# Altium schematic sheet PX4FLOW2.0_Power_X0.SchDoc
size A3; DrawnBy: Philip Rowse
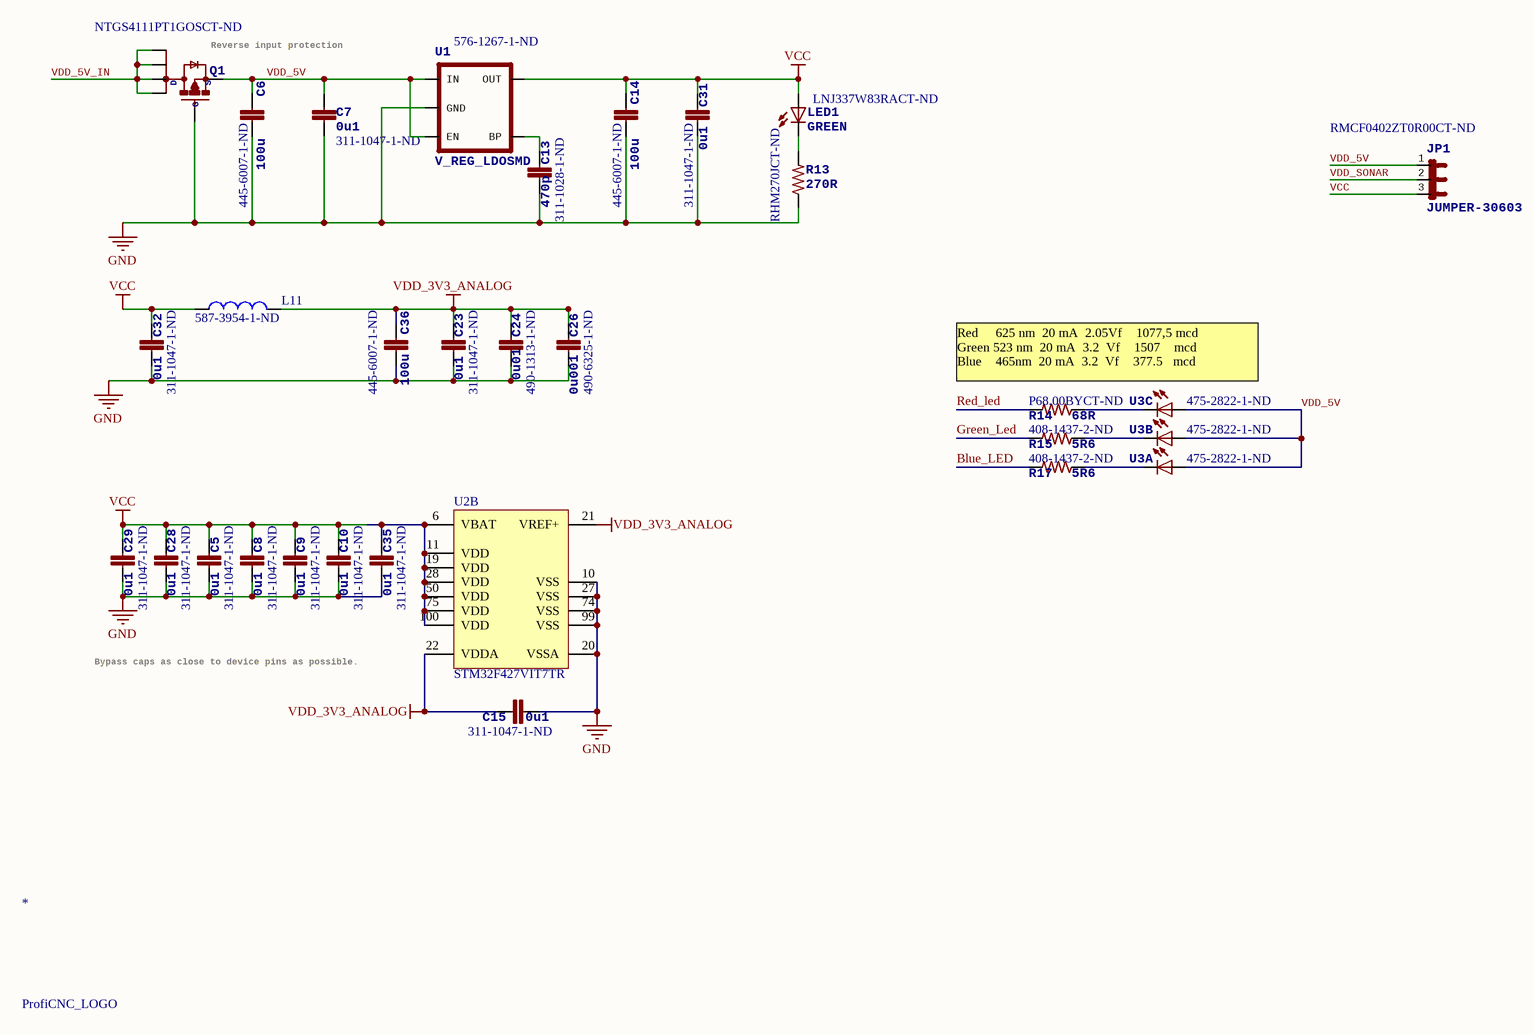
[diagram p0: PX4FLOW2.0_Power_X0.SchDoc]

## Parts
*  ProfiCNC_LOGO  [ProfiCNC_medium]  (no BOM)
C5  0u1  Supplier Part Number 1: 311-1047-1-ND  [0402-CAP]
C6  100u  Supplier Part Number 1: 445-6007-1-ND  [1206-CAP]
C7  0u1  Supplier Part Number 1: 311-1047-1-ND  [0402-CAP]
C8  0u1  Supplier Part Number 1: 311-1047-1-ND  [0402-CAP]
C9  0u1  Supplier Part Number 1: 311-1047-1-ND  [0402-CAP]
C10  0u1  Supplier Part Number 1: 311-1047-1-ND  [0402-CAP]
C13  470p  Supplier Part Number 1: 311-1028-1-ND  [0402-CAP]
C14  100u  Supplier Part Number 1: 445-6007-1-ND  [1206-CAP]
C15  0u1  Supplier Part Number 1: 311-1047-1-ND  [0402-CAP]
C23  0u1  Supplier Part Number 1: 311-1047-1-ND  [0402-CAP]
C24  0u01  Supplier Part Number 1: 490-1313-1-ND  [0402-CAP]
C26  0u001  Supplier Part Number 1: 490-6325-1-ND  [0402-CAP]
C28  0u1  Supplier Part Number 1: 311-1047-1-ND  [0402-CAP]
C29  0u1  Supplier Part Number 1: 311-1047-1-ND  [0402-CAP]
C31  0u1  Supplier Part Number 1: 311-1047-1-ND  [0402-CAP]
C32  0u1  Supplier Part Number 1: 311-1047-1-ND  [0402-CAP]
C35  0u1  Supplier Part Number 1: 311-1047-1-ND  [0402-CAP]
C36  100u  Supplier Part Number 1: 445-6007-1-ND  [1206-CAP]
JP1  JUMPER-30603  Supplier Part Number 1: RMCF0402ZT0R00CT-ND  [SJ_3_0603_PASTE1&2]
L11  Supplier Part Number 1: 587-3954-1-ND  [L0402]  (hidden comment: Inductor)
LED1  GREEN  Supplier Part Number 1: LNJ337W83RACT-ND  [LED-0603]
Q1  Supplier Part Number 1: NTGS4111PT1GOSCT-ND  [TSOP-6]  (hidden comment: NTGS4111P)
R13  270R  Supplier Part Number 1: RHM270JCT-ND  [R0402]
R14  68R  Supplier Part Number 1: P68.00BYCT-ND  [0603-RES]
R15  5R6  Supplier Part Number 1: 408-1437-2-ND  [0603-RES]
R17  5R6  Supplier Part Number 1: 408-1437-2-ND  [0603-RES]
U1  V_REG_LDOSMD  Supplier Part Number 1: 576-1267-1-ND  [SOT23-5]
U2  STM32F427VIT7TR  [STM-LQFP100_N]  (part B of 2)
U3  Supplier Part Number 1: 475-2822-1-ND  [6-PLCC]  (hidden comment: LRTB GFTG-T7AW-1+V7A7-29+R5T9-49-L)  (parts A,B,C of 3)

## Nets
GND: C5.2 C6.P$2 C7.1 C8.2 C9.2 C10.2 C13.2 C14.P$2 C15.2 C23.2 C24.2 C26.2 C28.2 C29.2 C31.2 C32.2 C35.2 C36.P$2 Q1.3(G) R13.1 U1.2(GND) U2.10(VSS) U2.20(VSSA) U2.27(VSS) U2.74(VSS) U2.99(VSS)
VCC: C5.1 C8.1 C9.1 C10.1 C14.P$1 C28.1 C29.1 C31.1 C32.1 C35.1 JP1.3 L11.1 LED1.A U1.5(OUT) U2.6(VBAT) U2.11(VDD) U2.19(VDD) U2.28(VDD) U2.50(VDD) U2.75(VDD) U2.100(VDD)
VDD_3V3_ANALOG: C15.1 C23.1 C24.1 C26.1 C36.P$1 L11.2 U2.21(VREF+) U2.22(VDDA)
Blue_LED: R17.2
Green_Led: R15.2
Red_led: R14.2
VDD_5V: C6.P$1 C7.2 JP1.1 Q1.4(S) U1.1(IN) U1.3(EN) U3.A1(A) U3.A2(A) U3.A3(A)
VDD_5V_IN: Q1.1(D) Q1.2(D1) Q1.5(D2) Q1.6(D3)
VDD_SONAR: JP1.2
NetC13_1: C13.1 U1.4(BP)
NetLED1_C: LED1.C R13.2
NetR14_1: R14.1 U3.C3(C)
NetR15_1: R15.1 U3.C2(C)
NetR17_1: R17.1 U3.C1(C)

## Notes on the sheet
- (near Q1) Reverse input protection
- Red     625 nm  20 mA  2.05Vf    1077,5 mcd
  Green 523 nm  20 mA  3.2  Vf    1507    mcd
  Blue    465nm  20 mA  3.2  Vf    377.5   mcd
- Bypass caps as close to device pins as possible.
- http://www.oshwa.org/
- http://creativecommons.org/licenses/by-sa/3.0/
- Title:
- Date:
- Time:
- Sheet:
- Approved:
- of:
- Drawn By:
- Checked By:
- ProfiCNC

## Library data of the parts
C5 C7-C10 C15 C23 C24 C26 C28 C29 C31 C32 = CAP0402-CAP: CapacitorStandard 0603 ceramic capacitor, and 0.1" leaded capacitor.; PARTNO: CC0402ZRY5V7BB104; Supplier 1: Digi-Key
C6 C14 C36 = CAP1206: CAP CER 100UF 10V 20% X5R 1206; PARTNO: C3216X5R1A107M160AC; 3DR_PARTNO: ECM0716; Supplier 1: Digi-Key; Value: 100U
C13 = CAP0402-CAP: CapacitorStandard 0603 ceramic capacitor, and 0.1" leaded capacitor.; PARTNO: CC0402KRX7R9BB471; Supplier 1: Digi-Key
C35 = CAP0402-CAP: 0402; PARTNO: CC0402ZRY5V7BB104; Supplier 1: Digi-Key
JP1 = JUMPER-30603: PARTNO: RMCF0402ZT0R00; Supplier 1: Digi-Key
L11 = Inductor: FERRITE BEAD 120 OHM 0402; Supplier 1: Digi-Key
LED1 = LED0603: Green LED; PARTNO: LNJ337W83RA; Supplier 1: Digi-Key
R13 = RESISTOR0402-RES: ResistorBasic schematic elements and footprints for 0603, 1206, and PTH 1/10th watt (small) resistors.; PARTNO: MCR01MZPJ271; Supplier 1: Digi-Key
R14 = RESISTOR0402-RES: RES SMD 68 OHM 1% 1/4W 0603; PARTNO: ERJ-PA3F68R0V; Supplier 1: Digi-Key
R15 R17 = RESISTOR0402-RES: RES SMD 5.6 OHM 1% 1/5W 0603; PARTNO: RL0816S-5R6-F; Supplier 1: Digi-Key
U1 = V_REG_LDOSMD: Voltage Regulator LDOStandard 150mA LDO voltage regulator in SOT-23 layout. Micrel part MIC5205. BP (by-pass) pin is used to lower output noise with 470pF cap.; PARTNO: MIC5207-3.3YM5; Supplier 1: Digi-Key
U2 = STM32F427VIT7TR: ARM Cortex-M4 32-bit MCU+FPU, 210 DMIPS, 2048 kB Flash, 256 kB Internal RAM, 82 I/Os, 100-pin LQFP, -40 to 105 degC, Tape and Reel; Manufacturer: STMicroelectronics; D/A Converter: 2x12-bit; FLASH Size (Prog) (kB): 2048; I/Os (High Current): 82; Internal RAM Size (kB): 256; Operating Frequency(F) (Processor speed) (MHz): 168; Supply Voltage(Vcc) max (V): 3.6; Supply Voltage(Vcc) min (V): 1.8; DatasheetVersion: Rev. 1; PackageVersion: Rev. 1, 06/2013; PackageReference: LQFP100; PackageDescription: 100-Pin Low Profile Quad Flat Package, 14 x 14 mm Body, 0.5 mm Pitch; Supplier 1: Newark; Supplier Part Number 1: 19X6230; Supplier 2: Mouser; Supplier Part Number 2: 511-STM32F427VIT7TR; Core: ARM Cortex-M4; Packing: Tape and Reel; Mounting Technology: Surface Mount; PartNumber: STM32F427VIT7TR; ComponentLink1Description: Manufacturer URL; ComponentLink1URL: http://www.st.com/web/en/home.html; ComponentLink2Description: Datasheet; ComponentLink2URL: http://www.st.com/st-web-ui/static/active/en/resource/technical/document/datasheet/DM00071990.pdf; ComponentLink3Description: Package Specification; ComponentLink3URL: http://www.st.com/st-web-ui/static/active/en/resource/technical/document/data_brief/DM00071938.pdf
U3 = RGB-LED6-PLCC: RGB LED with separate anode/cathode terminals; Supplier 1: Digi-Key
Q1 = NTGS4111P: PARTNO: NTGS4111P; D: D; S: S; G: G; Supplier 1: Digi-Key